# EAGLE design zTable (EAGLE 6.5.0)
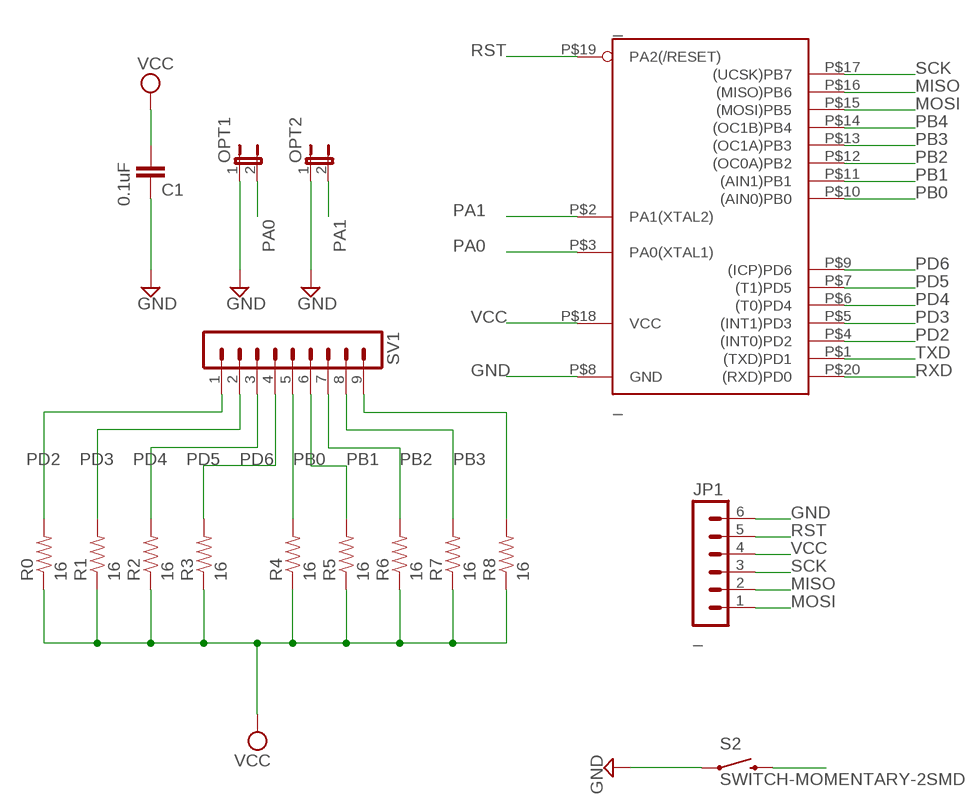
[diagram p0: schematic, sheet 1]

## Parts
_  _  TINY2313-*M*  [MLF20]
C1  0.1uF  CAP0805  [0805]
JP1  _  MA06-1  [MA06-1]
OPT1  JUMPER-2PTH  [1X02]
OPT2  JUMPER-2PTH  [1X02]
R0  16  RESISTOR  [0805]
R1  16  RESISTOR  [0805]
R2  16  RESISTOR  [0805]
R3  16  RESISTOR  [0805]
R4  16  RESISTOR  [0805]
R5  16  RESISTOR  [0805]
R6  16  RESISTOR  [0805]
R7  16  RESISTOR  [0805]
R8  16  RESISTOR  [0805]
S2  SWITCH-MOMENTARY-2SMD  [TACTILE_SWITCH_SMD]
SV1  MA09-1  [MA09-1]

## Nets
GND [power]: _.P$8(GND) C1.2 JP1.6 OPT1.1 OPT2.1 S2.1
MISO: _.P$16((MISO)PB6) JP1.2
MOSI: _.P$15((MOSI)PB5) JP1.1
PA0: _.P$3(PA0(XTAL1)) OPT1.2
PA1: _.P$2(PA1(XTAL2)) OPT2.2
PB0: _.P$10((AIN0)PB0) R5.2 SV1.6
PB1: _.P$11((AIN1)PB1) R6.2 SV1.7
PB2: _.P$12((OC0A)PB2) R7.2 SV1.8
PB3: _.P$13((OC1A)PB3) R8.2 SV1.9
PB4: _.P$14((OC1B)PB4) S2.3
PD2: _.P$4((INT0)PD2) R0.2 SV1.1
PD3: _.P$5((INT1)PD3) R1.2 SV1.2
PD4: _.P$6((T0)PD4) R2.2 SV1.3
PD5: _.P$7((T1)PD5) R3.2 SV1.4
PD6: _.P$9((ICP)PD6) R4.2 SV1.5
RST: _.P$19(PA2(/RESET)) JP1.5
RXD: _.P$20((RXD)PD0)
SCK: _.P$17((UCSK)PB7) JP1.3
TXD: _.P$1((TXD)PD1)
VCC [power]: _.P$18(VCC) C1.1 JP1.4 R0.1 R1.1 R2.1 R3.1 R4.1 R5.1 R6.1 R7.1 R8.1

## Library data of the parts
_ = NSL_Cylon:TINY2313*: Atmel Tiny2313 2K Flash, 128 bytes EEPROM, 128 bytes RAM
C1 = SparkFun:CAP: Capacitor Standard 0603 ceramic capacitor, and 0.1" leaded capacitor.
JP1 = con-lstb:MA06-1: PIN HEADER
OPT1 OPT2 = SparkFun:JUMPER-2: Jumper Basic 0.1" spaced jumper. Use with breakaway headers.
R0 R1-R8 = SparkFun:RESISTOR: Resistor Basic schematic elements and footprints for 0603, 1206, and PTH 1/10th watt (small) resistors.
S2 = SparkFun:SWITCH-MOMENTARY-2
SV1 = con-lstb:MA09-1: PIN HEADER; OC_FARNELL: unknown; OC_NEWARK: unknown

## Net classes
1 power: width 0.254 mm
2 leds: width 0.508 mm

## Board
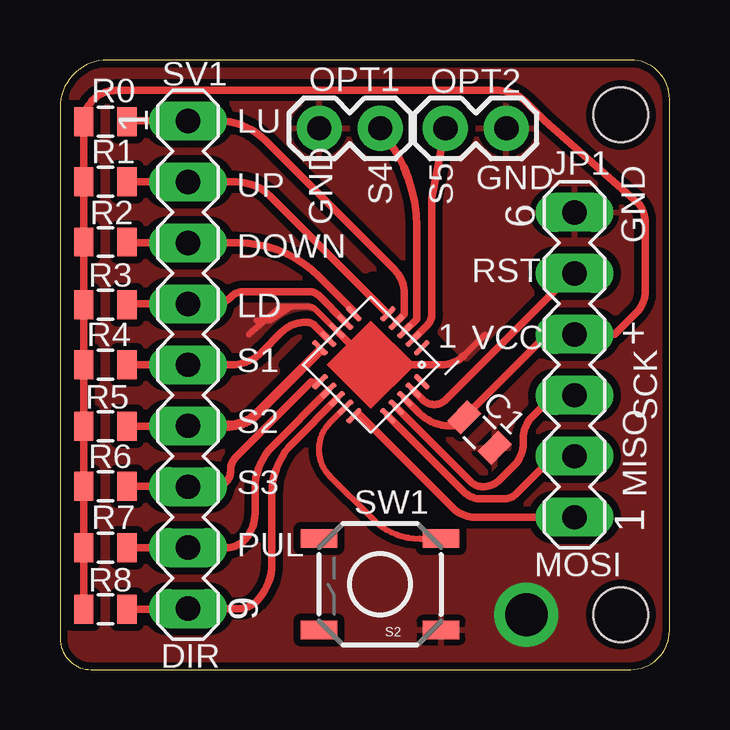
[diagram p1: board, top side]
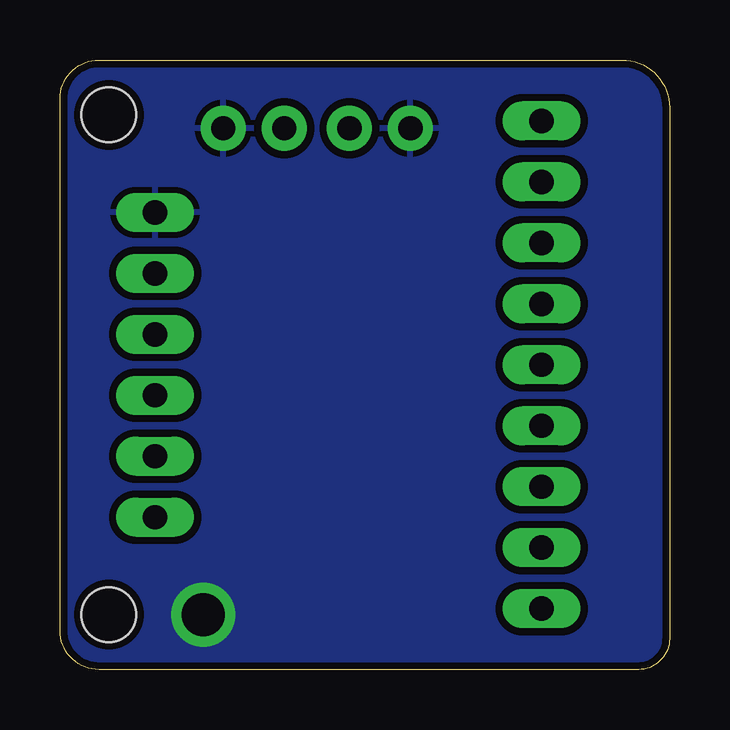
[diagram p2: board, bottom side, seen from below]

Size 25.4 x 25.4 mm. Coordinates in mm from the lower left corner, seen from the top.
Outline: 0,23.42 0,1.29 arc90 1.29,0 23.77,0 arc90 25.4,1.63 25.4,23.77 arc90 23.77,25.4 1.98,25.4 arc90 0,23.42
Copper layers (1*16): Top 0.0356mm / dielectric 1.5011mm / Bottom 0.0356mm
Design rules "SparkFun-mod *": minimum track width 10mil, minimum drill 20mil, track to track 6mil, track to pad 6mil, pad to pad 8mil, via to via 8mil, smd to smd 8mil, copper to edge 12mil, drill to drill 8mil, minimum pad ring 12mil, minimum via ring 10mil, stop-mask expansion 4mil, vias tented up to drill 25mil, thermal gap 10mil
Holes 2.29 mm at 23.37,2.29 23.37,23.11
tRestrict: area 9.4,9.1 to 16.6,16.3
Milling: 8 lines

### Footprints (pad centres in the part's own frame; a part is rotated, then mirrored left to right if it is on the bottom)
MLF20 = smd 0.8 x 0.23: P$1 -2,1; P$2 -2,0.5; P$3 -2,0; P$4 -2,-0.5; P$5 -2,-1; P$11 2,-1; P$12 2,-0.5; P$13 2,0; P$14 2,0.5; P$15 2,1 | smd 0.23 x 0.8: P$6 -1,-2; P$7 -0.5,-2; P$8 0,-2; P$9 0.5,-2; P$10 1,-2; P$16 1,2; P$17 0.5,2; P$18 0,2; P$19 -0.5,2; P$20 -1,2
0805 = smd 0.8 x 1.2: 1 -0.9,0; 2 0.9,0
MA06-1 = drill 1.016 long: 1 -6.35,0; 2 -3.81,0; 3 -1.27,0; 4 1.27,0; 5 3.81,0; 6 6.35,0
1X02 = drill 1.016 pad 1.88: 1 0,0; 2 2.54,0
TACTILE_SWITCH_SMD = smd 1.524 x 0.762: 1 -2.54,1.905; 2 2.54,1.905; 3 -2.54,-1.905; 4 2.54,-1.905
MA09-1 = drill 1.016 long: 1 -10.16,0; 2 -7.62,0; 3 -5.08,0; 4 -2.54,0; 5 0,0; 6 2.54,0; 7 5.08,0; 8 7.62,0; 9 10.16,0

### Placement (x,y rotation side)
_  12.95,12.7 225 top
C1  17.47,9.87 315 top
JP1  21.44,12.7 90 top
OPT1  10.8,22.55 0 top
OPT2  18.6,22.55 180 top
R0  1.89,22.83 0 top
R1  1.89,20.33 0 top
R2  1.89,17.81 0 top
R3  1.89,15.2 0 top
R4  1.89,12.7 0 top
R5  1.89,10.14 0 top
R6  1.89,7.64 0 top
R7  1.89,5.07 0 top
R8  1.89,2.51 0 top
S2  13.34,3.56 180 top
SV1  5.33,12.7 270 top

### Tracks (layer width: path | path; a pad name or v marks a point on that pad's centre or on a via)
GND  (via drill 1.78)
  Top 0.254: 9.65,15.11 8.76,14.54 8.19,14.54 | 17.72,13.97 16.83,13.08 | 9.65,15.11 9.21,15.11 7.87,13.97 | _.P$8 10.63,15.02 arc45 10.41,15.11 9.65,15.11
  Top 0.305: _.P$8 12.95,12.7 15.9,12.7 arc45 16.83,13.08
  other vias: 19.43,2.29
  pour Top (isolate 0.305): 25.53,-1.65 25.53,27.18 -0.96,27.18 arc90 -3.3,22.3 -3.3,1.9 arc90 -2.17,-1.78
  pour Bottom (isolate 0.305): 26.92,-2.54 -3.56,-2.54 -3.56,27.94 26.92,27.94
MISO
  Top 0.254: 20.57,8.89 JP1.2
  Top 0.305: _.P$16 16.82,7.42 arc45 17.56,7.11 18.5,7.11 arc45 19.01,7.32 20.57,8.89
MOSI
  Top 0.254: _.P$15 12.54,10.58
  Top 0.305: 12.54,10.58 16.39,6.72 arc45 17.29,6.35 JP1.1
PA0
  Top 0.305: _.P$3 14.86,14.6 14.86,18.46 arc39 13.52,22.25 OPT1.2
PA1
  Top 0.254: _.P$2 14.78,13.82
  Top 0.305: 14.78,13.82 15.29,14.33 arc45 15.49,14.83 15.49,19.45 arc-11 15.54,19.96 OPT2.2
PB0
  Top 0.254: _.P$10 10.83,13.28 | SV1.6 5.31,10.14
  Top 0.305: 5.31,10.14 R5.2
  Top 0.406: 10.83,13.28 8.21,10.65 arc-45 7.02,10.16 SV1.6
PB1
  Top 0.254: _.P$11 10.47,11.99 | SV1.7 5.32,7.64
  Top 0.305: 10.47,11.99 7.35,8.87 arc45 7.11,8.3 arc-45 6.9,7.8 6.72,7.62 SV1.7 | 5.32,7.64 R6.2
PB2
  Top 0.254: SV1.8
  Top 0.305: _.P$12 8.85,9.31 arc45 8.13,7.55 8.13,6.51 arc-45 7.66,5.37 arc-45 6.95,5.08 SV1.8 | SV1.8 R7.2
PB3
  Top 0.254: SV1.9 5.3,2.51
  Top 0.305: _.P$13 9.71,9.45 arc45 8.83,7.32 8.83,4.42 arc-45 8.17,2.83 arc-45 7.46,2.54 SV1.9 | 5.3,2.51 R8.2
PB4
  Top 0.254: _.P$14 11.25,10.29 arc90 11.25,8.06 13.05,6.26 arc45 14.97,5.46 S2.3
PD2
  Top 0.305: _.P$4 14.35,14.8 14.35,15.67 arc45 13.94,16.67 8.56,22.04 arc45 6.59,22.86 SV1.1 2.77,22.86 R0.2
PD3
  Top 0.254: SV1.2
  Top 0.305: _.P$5 8.75,19.73 arc45 7.33,20.32 SV1.2 | SV1.2 R1.2
PD4
  Top 0.254: _.P$6 12.25,14.93 | R2.2 2.77,17.78
  Top 0.305: 12.25,14.93 10.8,16.38 arc45 7.41,17.78 SV1.3 2.77,17.78
PD5
  Top 0.254: R3.2 2.78,15.24
  Top 0.305: _.P$7 10.77,15.59 arc45 10.39,15.75 7.65,15.75 arc45 7.14,15.54 arc-45 6.43,15.24 SV1.4 2.78,15.24
PD6
  Top 0.305: _.P$9 10.62,14.33 arc45 10.26,14.48 arc45 9.22,14.05 8.4,13.23 arc-45 7.13,12.7 SV1.5 R4.2
RST
  Top 0.254: 21.34,16.51 JP1.5
  Top 0.305: _.P$19 15.12,11.24 arc90 16.07,11.24 21.34,16.51
SCK
  Top 0.305: _.P$17 17.12,7.83 arc45 17.62,7.62 arc45 18.33,7.91 18.93,8.52 arc45 19.3,9.42 19.3,9.63 arc-45 19.68,10.53 20.57,11.43 JP1.3
VCC
  Top 0.254: R5.1 1.02,10.11
  Top 0.305: _.P$18 14.97,10.69 arc45 16.24,10.16 16.49,10.16 C1.1 20.3,13.97 JP1.4 23.11,13.97 24.01,14.87 arc45 24.38,15.77 24.38,18.63 arc37 24.13,19.39 20.19,22.86 19.38,23.68 arc45 18.28,24.13 2.34,24.13 arc90 R0.1 R1.1 R2.1 R3.1 R4.1 R5.1 R6.1 R7.1 R8.1

### Text on the board
tNames: LU | UP | S4 | S5 | GND | GND | GND | DOWN | RST | LD | 1 | VCC | + | SCK | S1 | S2 | S3 | SW1 | MISO | PUL | MOSI | DIR
_tsilk: i/o | CYLON | charliex | 032.la | GD | RS | o | 3V | SK | MI | MO | i/o | [NSL]